# Altium project Raspberry_UART_Arduino.PrjPcb
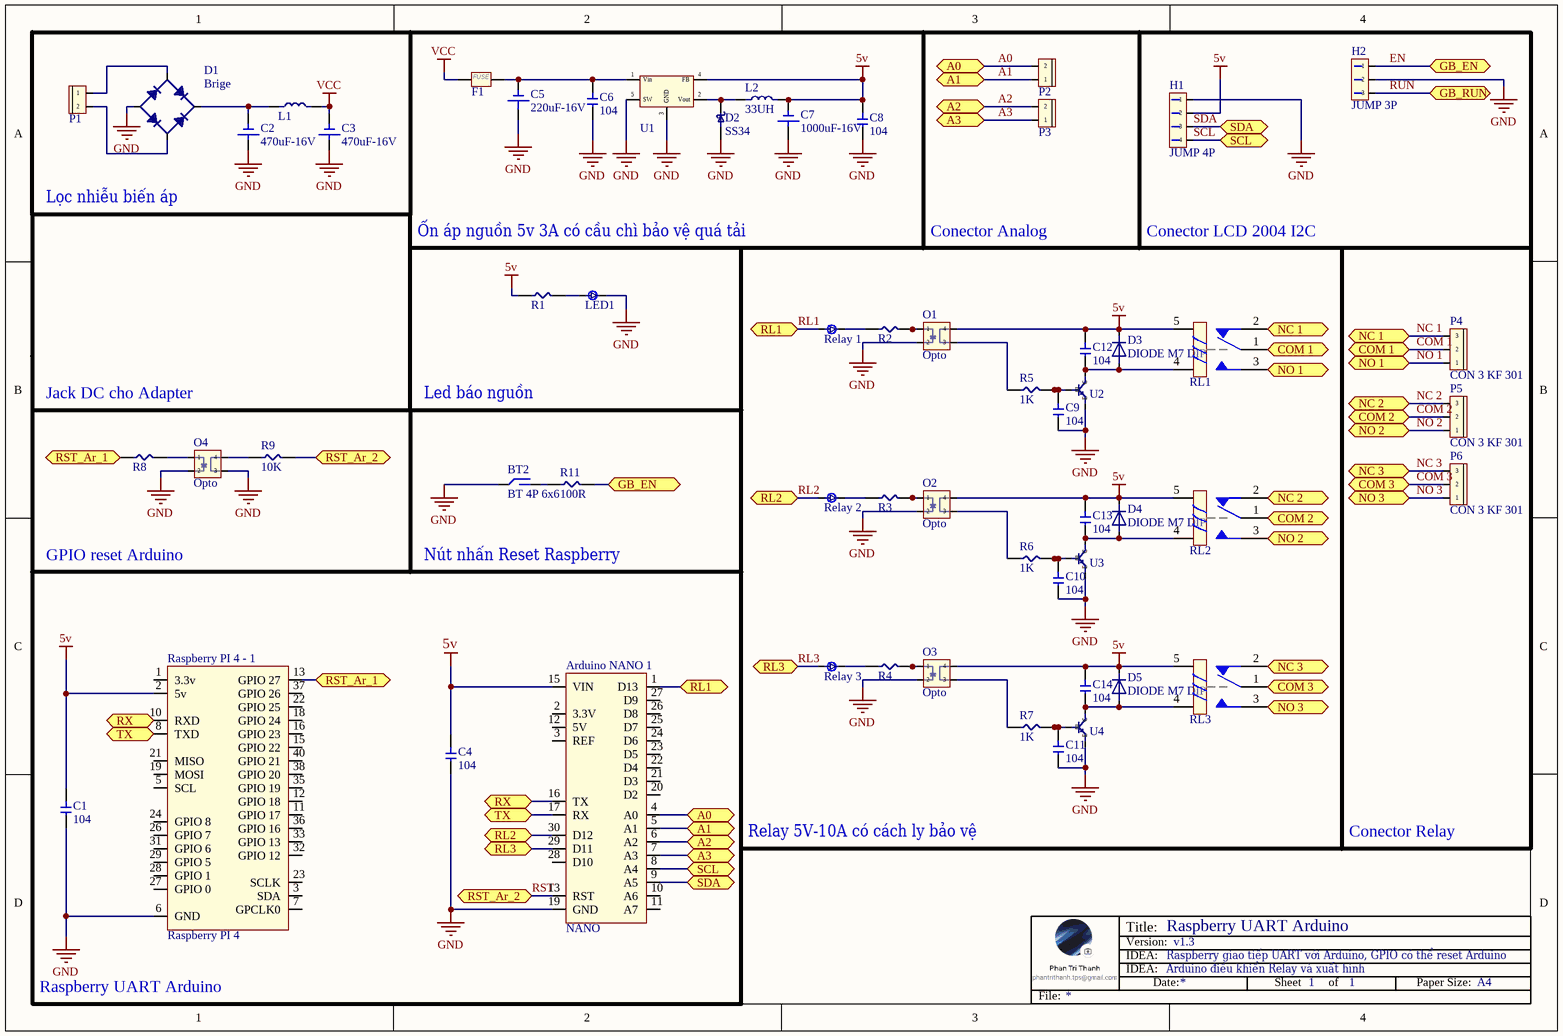
[diagram p0: Schematic.SchDoc]
1 sheet, 58 parts. Net scope: flat (ports and power ports of the same name join across sheets).
Board file: PCB.PcbDoc

## Sheet Schematic.SchDoc: Raspberry UART Arduino
size A4; SheetNumber: 1; SheetTotal: 1; Version: v1.3; Idea1: Raspberry giao tiếp UART với Arduino, GPIO có thể reset Arduino; Idea2: Arduino điều khiển Relay và xuất hình

### Parts
Arduino_NANO_1  NANO  [ARDUINO NANO]
BT2  BT 4P 6x6  [Button 4pin nho]
C1  104  [Tu gom]
C2  470uF-16V  [tu hoa 8mm]
C3  470uF-16V  [tu hoa 8mm]
C4  104  [Tu gom]
C5  220uF-16V  [tu hoa 6.5mm]
C6  104  [Tu gom]
C7  1000uF-16V  [tu hoa 8mm]
C8  104  [Tu gom]
C9  104  [Tu gom]
C10  104  [Tu gom]
C11  104  [Tu gom]
C12  104  [Tu gom]
C13  104  [Tu gom]
C14  104  [Tu gom]
D1  Brige  [Diode Cau]
D2  SS34  [DIODE 2A]
D3  DIODE M7 DIP  [DIODE 1A]
D4  DIODE M7 DIP  [DIODE 1A]
D5  DIODE M7 DIP  [DIODE 1A]
F1  CAU CHI 30V-3A DIP  [RUEF400]  (value not drawn)
H1  JUMP 4P  [Jump 4]
H2  JUMP 3P  [Jump 3]
L1  100UH  [100uH_3A]  (value not drawn)
L2  33UH  [100uH_3A]
LED1  LED 3MM RED  [LED 3mm Do]  (value not drawn)
O1  Opto  [PC817 DIP]
O2  Opto  [PC817 DIP]
O3  Opto  [PC817 DIP]
O4  Opto  [PC817 DIP]
P1  CON 2 KF 301  [CON 2KF 301]  (value not drawn)
P2  CON 2 KF 301  [CON 2KF 301]  (value not drawn)
P3  CON 2 KF 301  [CON 2KF 301]  (value not drawn)
P4  CON 3 KF 301  [CON 3KF 301]
P5  CON 3 KF 301  [CON 3KF 301]
P6  CON 3 KF 301  [CON 3KF 301]
R1  560R  [Tro Vach 1/4W]  (value not drawn)
R2  560R  [Tro Vach 1/4W]  (value not drawn)
R3  560R  [Tro Vach 1/4W]  (value not drawn)
R4  560R  [Tro Vach 1/4W]  (value not drawn)
R5  1K  [Tro Vach 1/4W]
R6  1K  [Tro Vach 1/4W]
R7  1K  [Tro Vach 1/4W]
R8  220R  [Tro Vach 1/4W]  (value not drawn)
R9  10K  [Tro Vach 1/4W]
R11  100R  [Tro Vach 1/4W]
Raspberry_PI_4_-_1  Raspberry PI 4  [RASPBERRY PI 4 - MOD]
Relay_1  LED 3MM GREEN  [LED 3MM X LA]  (value not drawn)
Relay_2  LED 3MM GREEN  [LED 3MM X LA]  (value not drawn)
Relay_3  LED 3MM GREEN  [LED 3MM X LA]  (value not drawn)
RL1  MH  [RELAY 5P]  (value not drawn)
RL2  MH  [RELAY 5P]  (value not drawn)
RL3  MH  [RELAY 5P]  (value not drawn)
U1  LM2596S - 5.0  [TO-263-5]  (value not drawn)
U2  Transistor NPN  [TO-92]  (value not drawn)
U3  Transistor NPN  [TO-92]  (value not drawn)
U4  Transistor NPN  [TO-92]  (value not drawn)

### Blocks framed on the sheet
Lọc nhiễu biến áp: C2 C3 D1 L1 P1

### Ports
A0, A1, A2, A3, COM 1, COM 2, COM 3, GB_EN, GB_RUN, NC 1, NC 2, NC 3, NO 1, NO 2, NO 3, RL1, RL2, RL3, RST_Ar_1, RST_Ar_2, RX, SCL, SDA, TX

### Nets
3.3v: Raspberry_PI_4_-_1.17(3.3v)
5v: Arduino_NANO_1.15(VIN) C1.1 C4.1 C7.1 C8.1 C12.1 C13.1 C14.1 D3.2(K) D4.2(K) D5.2(K) H1.2 L2.2 O1.4 O2.4 O3.4 R1.1 Raspberry_PI_4_-_1.2(5v) Raspberry_PI_4_-_1.4(5v) RL1.5 RL2.5 RL3.5 U1.4(FB)
GND: Arduino_NANO_1.14(GND) Arduino_NANO_1.19(GND) BT2.1 C1.2 C2.2 C3.2 C4.2 C5.2 C6.2 C7.2 C8.2 C9.2 C10.2 C11.2 D1.4(-) D2.1(A) H1.1 H2.2 LED1.2 O1.2 O2.2 O3.2 O4.2 O4.3 Raspberry_PI_4_-_1.6(GND) Raspberry_PI_4_-_1.9(GND) Raspberry_PI_4_-_1.14(GND) Raspberry_PI_4_-_1.20(GND) Raspberry_PI_4_-_1.25(GND) Raspberry_PI_4_-_1.30(GND) Raspberry_PI_4_-_1.34(GND) Raspberry_PI_4_-_1.39(GND) U1.3(GND) U1.5(SW) U2.3(E) U3.3(E) U4.3(E)
RST: Arduino_NANO_1.13(RST) Arduino_NANO_1.18(RST) R9.2 ; port RST_Ar_2
VCC: C3.1 F1.1 L1.2
A0: Arduino_NANO_1.4(A0) P2.2 ; port A0
A1: Arduino_NANO_1.5(A1) P2.1 ; port A1
A2: Arduino_NANO_1.6(A2) P3.2 ; port A2
A3: Arduino_NANO_1.7(A3) P3.1 ; port A3
COM 1: P4.2 RL1.1 ; port COM 1
COM 2: P5.2 RL2.1 ; port COM 2
COM 3: P6.2 RL3.1 ; port COM 3
EN: H2.1 R11.2 ; port GB_EN
NC 1: P4.3 RL1.2 ; port NC 1
NC 2: P5.3 RL2.2 ; port NC 2
NC 3: P6.3 RL3.2 ; port NC 3
NO 1: P4.1 RL1.3 ; port NO 1
NO 2: P5.1 RL2.3 ; port NO 2
NO 3: P6.1 RL3.3 ; port NO 3
RL1: Arduino_NANO_1.1(D13) Relay_1.1 ; port RL1
RL2: Arduino_NANO_1.30(D12) Relay_2.1 ; port RL2
RL3: Arduino_NANO_1.29(D11) Relay_3.1 ; port RL3
RUN: H2.3 ; port GB_RUN
SCL: Arduino_NANO_1.8(A4) H1.4 ; port SCL
SDA: Arduino_NANO_1.9(A5) H1.3 ; port SDA
NetArduino_NANO_1_16: Arduino_NANO_1.16(TX) Raspberry_PI_4_-_1.10(RXD) ; port RX
NetArduino_NANO_1_17: Arduino_NANO_1.17(RX) Raspberry_PI_4_-_1.8(TXD) ; port TX
NetBT2_2: BT2.2 R11.1
NetC2_1: C2.1 D1.1(+) L1.1
NetC5_1: C5.1 C6.1 F1.2 U1.1(Vin)
NetC9_1: C9.1 R5.2 U2.1(B)
NetC10_1: C10.1 R6.2 U3.1(B)
NetC11_1: C11.1 R7.2 U4.1(B)
NetC12_2: C12.2 D3.1(A) RL1.4 U2.2(C)
NetC13_2: C13.2 D4.1(A) RL2.4 U3.2(C)
NetC14_2: C14.2 D5.1(A) RL3.4 U4.2(C)
NetD1_2: D1.2 P1.1
NetD1_3: D1.3 P1.2
NetD2_2: D2.2(K) L2.1 U1.2(Vout)
NetLED1_1: LED1.1 R1.2
NetO1_1: O1.1 R2.2
NetO1_3: O1.3 R5.1
NetO2_1: O2.1 R3.2
NetO2_3: O2.3 R6.1
NetO3_1: O3.1 R4.2
NetO3_3: O3.3 R7.1
NetO4_1: O4.1 R8.2
NetO4_4: O4.4 R9.1
NetR2_1: R2.1 Relay_1.2
NetR3_1: R3.1 Relay_2.2
NetR4_1: R4.1 Relay_3.2
NetR8_1: R8.1 Raspberry_PI_4_-_1.13(GPIO_27) ; port RST_Ar_1

Not connected (* = marked no-connect by the designer): Arduino_NANO_1 2(3.3V) 3(REF) 10(A6) 11(A7) 12(5V) 20(D2) 21(D3) 22(D4) 23(D5) 24(D6) 25(D7) 26(D8) 27(D9) 28(D10); Raspberry_PI_4_-_1 1(3.3v) 3(SDA) 5(SCL) 7(GPCLK0) 11(GPIO_17) 12(GPIO_18) 15(GPIO_22) 16(GPIO_23) 18(GPIO_24) 19(MOSI) 21(MISO) 22(GPIO_25) 23(SCLK) 24(GPIO_8) 26(GPIO_7) 27(GPIO_0) 28(GPIO_1) 29(GPIO_5) 31(GPIO_6) 32(GPIO_12) 33(GPIO_13) 35(GPIO_19) 36(GPIO_16) 37(GPIO_26) 38(GPIO_20) 40(GPIO_21)

### Notes on the sheet
- Ổn áp nguồn 5v 3A có cầu chì bảo vệ quá tải
- Conector Analog
- Conector LCD 2004 I2C
- Jack DC cho Adapter
- Led báo nguồn
- GPIO reset Arduino
- Nút nhấn Reset Raspberry
- Relay 5V-10A có cách ly bảo vệ
- Conector Relay
- Raspberry UART Arduino
- Title:
- Version:
- IDEA:
- Date:
- Sheet
- of
- Paper Size:
- A4
- File:
- (in symbol CAU CHI 30V-3A DIP) FUSE

### Library data of the parts
Arduino_NANO_1 = Arduino NANO: Tên LK: Arduino Nano 3.0 328 Mini CH340; ĐVT: Cái; Chủng Loại: Module; Số Chân: 30; Kiểu Chân: DIP; Nơi Bán: banlinhkien.com
BT2 = BT 4P 6x6: Button 6cm x 6cm; Tên LK: Nút Nhấn 4 Chân 6x6x9MM DIP; Mã MH: MH004077; ĐVT: Con; Kiểu Chân: DIP; Số Chân: 4; Chủng Loại: Nút nhấn
C1 C4 C6 C8-C14 = TU GOM 104: 10uF; Chủng Loại: Tụ Gốm; ĐVT: Con; Kiểu Chân: DIP; Số Chân: 2; Tên LK: Tụ Gốm 104 100nF 50V (10c); Nơi Bán: banlinhkien.com
C2 C3 = TU HOA 470uF 16V 8x11: Cắm; Chủng Loại: Tụ cắm; Kiểu Chân: DIP; ĐVT: Con; Số Chân: 2; Tên LK: Tụ Hóa 470uF 16V 8x11MM; Mã MH: MH006550
C5 = TU HOA 220uF 16V 7x11: Cắm; Chủng Loại: Tụ cắm; ĐVT: Con; Tên LK: Tụ Hóa 220uF 16V 7x11MM; Kiểu Chân: DIP; Số Chân: 2; Nơi bán: banlinhkien.com
C7 = TU HOA 1000uF 16V 8x20: Cắm; Chủng Loại: Tụ hóa; ĐVT: Con; Tên LK: Tụ Hóa 1000uF 16V 8x20MM; Kiểu Chân: DIP; Số Chân: 2; Nơi Bán: banlinhkien.com
D1 = Diode Cầu 3A 700V KBP307: Cầu; Chủng Loại: Diode; ĐVT: Con; Kiểu Chân: DIP; Số Chân: 4; Nơi Bán: banlinhkien.com; Tên LK: Diode Cầu 3A 700V KBP307
D2 = DIODE SS34 DIP: Shotky; Chủng Loại: Diode; Kiểu chân: DIP; ĐVT: Con; Số Chân: 2; Tên LK: 1N5822 DO-210AD Diode Schottky 3A 40V (DIP); Nơi Bán: banlinhkien.com
D3-D5 = DIODE M7 DIP: Chình lưu; ĐVT: Con; Số Chân: 2; Tên LK: Diode 1N4007 1A (DIP) (10c); Nơi Bán: banlinhkien.com; Chủng Loại: Diode; Kiểu chân: DIP
F1 = CAU CHI 30V-3A DIP: Cầu chì tự phục hồi; ĐVT: Con; Tên LK: Cầu Chì Tự Phục Hồi 3A 30V DIP RUEF300; Số Chân: 2; Nơi bán: banlinhkien.com; Chủng Loại: Cầu chì tự phục hồi; Kiểu Chân: DIP
H1 = JUMP 4P: JUMP 2.54; Chủng Loại: Connector; Kiểu Chân: DIP; ĐVT: Cái; Số Chân: 4; Mã MH: MH001164; Tên LK: Jump Đơn Đực 2.0MM 1x40P Thẳng
H2 = JUMP 3P: JUMP 2.54; Chủng Loại: Connector; Kiểu Chân: DIP; ĐVT: Cái; Số Chân: 3; Mã MH: MH001164; Tên LK: Jump Đơn Đực 2.0MM 1x40P Thẳng
L1 = CUON CAM 100UH DIP: LM2576; Chủng Loại: Cuộn Cảm; Kiểu Chân: DIP; ĐVT: Con; Số Chân: 2; Mã MH: MH001797; Tên LK: Cuộn Cảm 100UH 3A LM2576
L2 = CUON CAM 33UH DIP: LM2596; Chủng Loại: Cuộn Cảm; Kiểu Chân: DIP; ĐVT: Con; Số Chân: 2; Tên LK: Cuộn Cảm 33uH 3A LM2576; Nơi Bán: banlinhkien.com
LED1 = LED 3MM RED: 3MM ĐỎ; Kiểu Chân: DIP; ĐVT: Con; Số Chân: 2; Mã MH: MH003892; Tên LK: Led 3MM Phủ Đỏ (10c); Chủng Loại: LED
O1-O4 = PC817 DIP: Chủng Loại: Opto Quang; Kiểu Chân: DIP; Số Chân: 4; ĐVT: Con; Mã MH: MH000638; Tên LK: EL817 DIP4 OPTO (Thay Thế PC817 DIP)
P1-P3 = CON 2 KF 301: Connector; Kiểu Chân: DIP; Số Chân: 2; ĐVT: Cái; Mã MH: MH000987; Tên LK: CON 2 KF301-2P 5.08MM Xanh Dương (5 chiếc); Chủng Loại: Connector
P4-P6 = CON 3 KF 301: Connector; Kiểu Chân: DIP; Số Chân: 3; Tên LK: CON 3 KF301-3P 5.08MM Xanh Dương; Mã MH: MH000986; Chủng Loại: Connector; ĐVT: Con
R1-R4 = RES DIP 1/4W 560R: Trở Cắm; Chủng Loại: Trở Vạch; Kiểu Chân: DIP; Số Chân: 2; ĐVT: Con; Tên LK: Trở Vạch 1/4W 5% 560R (50c); Nơi bán: banlinhkien.com
R5-R7 = RES DIP 1/4W 1K: Trở Cắm; Chủng Loại: Trở Vạch; Kiểu Chân: DIP; Số Chân: 2; ĐVT: Con; Tên LK: Trở Vạch 1/4W 5% 1K (50c); Nơi Bán: banlinhkien.com; Giá Trị: 1K
R8 = RES DIP 1/4W 220R: Trở Cắm; Chủng Loại: Trở Vạch; Kiểu Chân: DIP; Số Chân: 2; ĐVT: Con; Nơi bán: banlinhkien.com; Tên LK: Trở Vạch 1/4W 5% 220R (50c)
R9 = RES DIP 1/4W 10K: Trở Cắm; Chủng Loại: Trở Vạch; Kiểu Chân: DIP; Số Chân: 2; ĐVT: Con; Nơi Bán: banlinhkien.com; Tên LK: Trở Vạch 1/4W 5% 10K (50c); Giá Trị: 10K
R11 = RES DIP 1/4W 100R: Trở Cắm; Chủng Loại: Trở Vạch; Kiểu Chân: DIP; Số Chân: 2; ĐVT: Con; Nơi Bán: banlinhkien.com; Tên LK: Trở Vạch 1/4W 5% 100R (50c); Giá Trị: 100R
Raspberry_PI_4_-_1 = Raspberry PI 4: Chủng Loại: Module; Số Chân: 40; Kiểu Chân: DIP; ĐVT: Cái; Nơi Bán: shoppe.vn; Tên LK: Raspberry Pi 4
Relay_1-Relay_3 = LED 3MM GREEN: 3MM X LÁ; Kiểu Chân: DIP; ĐVT: Con; Số Chân: 2; Mã MH: MH001054; Tên LK: Led 3MM Phủ Xanh (10c); Chủng Loại: LED
RL1-RL3 = Relay 5v 10A: Relay 5 chân; Kiểu Chân: DIP; Số Chân: 5; ĐVT: Con; Mã MH: MH009374; Tên LK: Relay 5V10A SRD-05VDC-SL-C Chính Hãng; Chủng Loại: Relay
U1 = LM2596S - 5.0: IC ổn áp dòng 3A; Chủng Loại: IC BUCK; Kiểu Chân: TO263; ĐVT: Con; Số Chân: 5; Tên LK: LM2596S-5.0V BUCK 5V 3A TO263-5; Mã MH: MH002359
U2-U4 = C1815 DIP: Trans NPN; Tên LK: C1815 TO92 TRANS NPN 0.15A 50V (DIP) (5c); Số Chân: 3; Kiểu Chân: DIP; ĐVT: Con; Nơi Bán: banlinhkien.com; Chủng Loại: Trans NPN